# EAGLE design env (EAGLE 7.6.0)
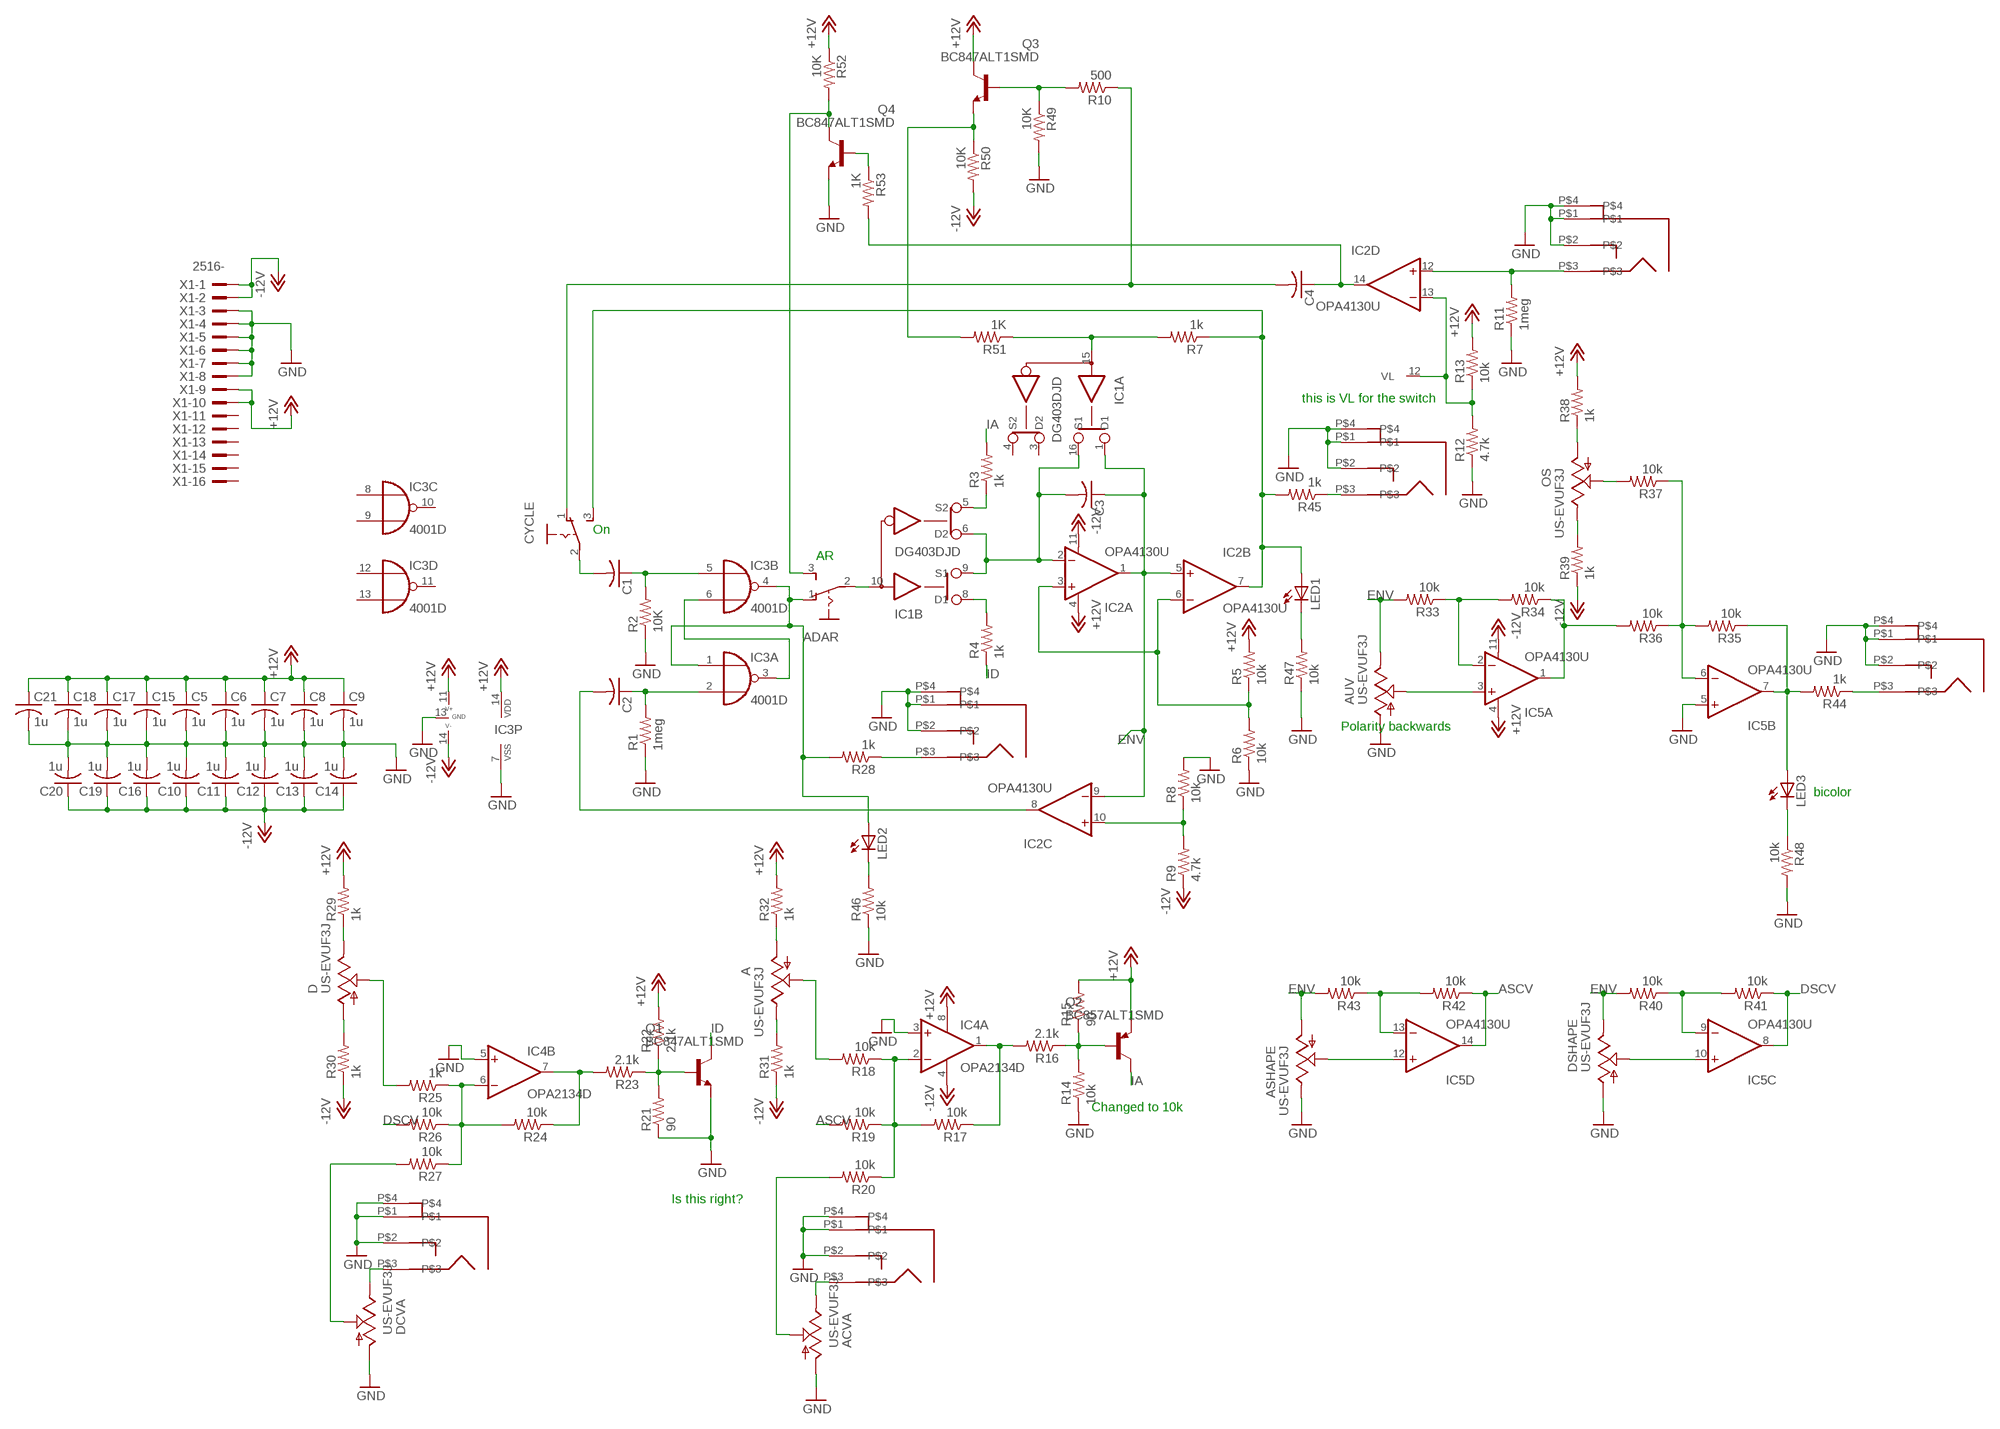
[diagram p0: schematic, sheet 1]

## Parts
A  US-EVUF3J  [EVUFXJ]
ACV  PJ301BM  [PJ301BM]
ACVA  US-EVUF3J  [EVUFXJ]
ADAR  255SB  [255SB]
ASHAPE  US-EVUF3J  [EVUFXJ]
AUV  US-EVUF3J  [EVUFXJ]
C1  C-USC0603  [C0603]
C2  C-USC0603  [C0603]
C3  C-USC0603  [C0603]
C4  C-USC0603  [C0603]
C5  1u  C-USC0603  [C0603]
C6  1u  C-USC0603  [C0603]
C7  1u  C-USC0603  [C0603]
C8  1u  C-USC0603  [C0603]
C9  1u  C-USC0603  [C0603]
C10  1u  C-USC0603  [C0603]
C11  1u  C-USC0603  [C0603]
C12  1u  C-USC0603  [C0603]
C13  1u  C-USC0603  [C0603]
C14  1u  C-USC0603  [C0603]
C15  1u  C-USC0603  [C0603]
C16  1u  C-USC0603  [C0603]
C17  1u  C-USC0603  [C0603]
C18  1u  C-USC0603  [C0603]
C19  1u  C-USC0603  [C0603]
C20  1u  C-USC0603  [C0603]
C21  1u  C-USC0603  [C0603]
CVOUT  PJ301BM  [PJ301BM]
CYCLE  255SB  [255SB]
D  US-EVUF3J  [EVUFXJ]
DCV  PJ301BM  [PJ301BM]
DCVA  US-EVUF3J  [EVUFXJ]
DSHAPE  US-EVUF3J  [EVUFXJ]
EOF  PJ301BM  [PJ301BM]
EOR  PJ301BM  [PJ301BM]
GATE  PJ301BM  [PJ301BM]
IC1  DG403DJD  [SO16]
IC2  OPA4130U  [SO14]
IC3  4001D  [SO14]
IC4  OPA2134D  [SOIC8]
IC5  OPA4130U  [SO14]
LED1  LED5MM  [LED5MM]
LED2  LED5MM  [LED5MM]
LED3  LED5MM  [LED5MM]
OS  US-EVUF3J  [EVUFXJ]
Q1  BC847ALT1SMD  [SOT23]
Q2  BC857ALT1SMD  [SOT23-BEC]
Q3  BC847ALT1SMD  [SOT23]
Q4  BC847ALT1SMD  [SOT23]
R1  1meg  R-US_R0603  [R0603]
R2  10K  R-US_R0603  [R0603]
R3  1k  R-US_R0603  [R0603]
R4  1k  R-US_R0603  [R0603]
R5  10k  R-US_R0603  [R0603]
R6  10k  R-US_R0603  [R0603]
R7  1k  R-US_R0603  [R0603]
R8  10k  R-US_R0603  [R0603]
R9  4.7k  R-US_R0603  [R0603]
R10  500  R-US_R0603  [R0603]
R11  1meg  R-US_R0603  [R0603]
R12  4.7k  R-US_R0603  [R0603]
R13  10k  R-US_R0603  [R0603]
R14  10k  R-US_R0603  [R0603]
R15  90  R-US_R0603  [R0603]
R16  2.1k  R-US_R0603  [R0603]
R17  10k  R-US_R0603  [R0603]
R18  10k  R-US_R0603  [R0603]
R19  10k  R-US_R0603  [R0603]
R20  10k  R-US_R0603  [R0603]
R21  90  R-US_R0603  [R0603]
R22  2.1k  R-US_R0603  [R0603]
R23  2.1k  R-US_R0603  [R0603]
R24  10k  R-US_R0603  [R0603]
R25  1k  R-US_R0603  [R0603]
R26  10k  R-US_R0603  [R0603]
R27  10k  R-US_R0603  [R0603]
R28  1k  R-US_R0603  [R0603]
R29  1k  R-US_R0603  [R0603]
R30  1k  R-US_R0603  [R0603]
R31  1k  R-US_R0603  [R0603]
R32  1k  R-US_R0603  [R0603]
R33  10k  R-US_R0603  [R0603]
R34  10k  R-US_R0603  [R0603]
R35  10k  R-US_R0603  [R0603]
R36  10k  R-US_R0603  [R0603]
R37  10k  R-US_R0603  [R0603]
R38  1k  R-US_R0603  [R0603]
R39  1k  R-US_R0603  [R0603]
R40  10k  R-US_R0603  [R0603]
R41  10k  R-US_R0603  [R0603]
R42  10k  R-US_R0603  [R0603]
R43  10k  R-US_R0603  [R0603]
R44  1k  R-US_R0603  [R0603]
R45  1k  R-US_R0603  [R0603]
R46  10k  R-US_R0603  [R0603]
R47  10k  R-US_R0603  [R0603]
R48  10k  R-US_R0603  [R0603]
R49  10K  R-US_R0603  [R0603]
R50  10K  R-US_R0603  [R0603]
R51  1K  R-US_R0603  [R0603]
R52  10K  R-US_R0603  [R0603]
R53  1K  R-US_R0603  [R0603]
X1  2516-  [PAK100/2500-16]

## Nets
+12V: C5.1 C6.1 C7.1 C8.1 C9.1 C15.1 C17.1 C18.1 C21.1 IC1.11(P:V+) IC2.4(A:V+) IC3.14(P:VDD) IC4.8(P:V+) IC5.4(A:V+) Q2.E Q3.3(C) R5.2 R13.2 R15.2 R22.2 R29.2 R32.2 R38.2 R52.1 X1.9 X1.10
-12V: C10.1 C11.1 C12.1 C13.1 C14.1 C16.1 C19.1 C20.1 IC1.14(P:V-) IC2.11(A:V-) IC4.4(P:V-) IC5.11(A:V-) R9.1 R30.1 R31.1 R39.1 R50.2 X1.1 X1.2
ASCV: IC5.14(D:OUT) R19.2 R42.1
DSCV: IC5.8(C:OUT) R26.2 R41.1
ENV: ASHAPE.1(A) AUV.3(E) C3.1 DSHAPE.3(E) IC1.1(A:D1) IC2.1(A:OUT) IC2.5(B:+IN) IC2.9(C:-IN) R33.2 R40.2 R43.2
GND: ACV.P$1 ACV.P$2 ACV.P$4 ACVA.1(A) ASHAPE.3(E) AUV.1(A) C5.2 C6.2 C7.2 C8.2 C9.2 C10.2 C11.2 C12.2 C13.2 C14.2 C15.2 C16.2 C17.2 C18.2 C19.2 C20.2 C21.2 CVOUT.P$1 CVOUT.P$2 CVOUT.P$4 DCV.P$1 DCV.P$2 DCV.P$4 DCVA.1(A) DSHAPE.1(A) EOF.P$1 EOF.P$2 EOF.P$4 EOR.P$1 EOR.P$2 EOR.P$4 GATE.P$1 GATE.P$2 GATE.P$4 IC1.13(P:GND) IC3.7(P:VSS) IC4.3(A:+IN) IC4.5(B:+IN) IC5.5(B:+IN) Q1.2(E) Q4.2(E) R1.1 R2.1 R6.1 R8.2 R11.1 R12.1 R14.1 R21.1 R46.1 R47.1 R48.2 R49.2 X1.3 X1.4 X1.5 X1.6 X1.7 X1.8
IA: Q2.C R3.2
ID: Q1.3(C) R4.1
N$1: IC3.3(A:O) IC3.6(B:I1)
N$2: ADAR.1(O) IC3.1(A:I0) IC3.4(B:O) LED2.A R28.2
N$3: C2.1 IC3.2(A:I1) R1.2
N$4: C1.1 IC3.5(B:I0) R2.2
N$5: C3.2 IC1.6(B:D2) IC1.9(B:S1) IC1.16(A:S1) IC2.2(A:-IN)
N$6: IC1.8(B:D1) R4.2
N$7: IC1.5(B:S2) R3.1
N$8: IC2.10(C:+IN) R8.1 R9.2
N$9: CYCLE.3(S) IC2.7(B:OUT) LED1.A R7.1 R45.2
N$10: AUV.2(S) IC5.3(A:+IN)
N$11: Q3.2(E) R50.1 R51.2
N$12: C2.2 IC2.8(C:OUT)
N$13: IC2.3(A:+IN) IC2.6(B:-IN) R5.1 R6.2
N$14: ADAR.3(S) Q4.3(C) R52.2
N$15: Q2.B R14.2 R15.1 R16.1
N$16: GATE.P$3 IC2.12(D:+IN) R11.2
N$17: IC1.12(VL:VL) IC2.13(D:-IN) R12.2 R13.1
N$18: ADAR.2(P) IC1.10(B:IN)
N$19: C1.2 CYCLE.2(P)
N$20: C4.1 IC2.14(D:OUT) R53.2
N$21: IC4.1(A:OUT) R16.2 R17.1
N$22: IC4.7(B:OUT) R23.2 R24.1
N$23: IC4.2(A:-IN) R17.2 R18.1 R19.1 R20.1
N$24: IC4.6(B:-IN) R24.2 R25.1 R26.1 R27.1
N$25: D.3(E) R29.1
N$26: Q1.1(B) R21.2 R22.1 R23.1
N$27: IC5.6(B:-IN) R35.2 R36.1 R37.1
N$28: A.1(A) R32.1
N$29: D.1(A) R30.2
N$30: A.3(E) R31.2
N$31: D.2(S) R25.2
N$32: A.2(S) R18.2
N$33: IC5.1(A:OUT) R34.1 R36.2
N$34: IC5.2(A:-IN) R33.1 R34.2
N$35: CVOUT.P$3 R44.1
N$36: IC5.7(B:OUT) LED3.A R35.1 R44.2
N$37: OS.1(A) R38.1
N$38: ACV.P$3 ACVA.3(E)
N$39: OS.3(E) R39.2
N$40: OS.2(S) R37.2
N$41: IC5.13(D:-IN) R42.2 R43.1
N$42: IC5.9(C:-IN) R40.1 R41.2
N$43: LED2.K(C) R46.2
N$44: DCV.P$3 DCVA.3(E)
N$45: ASHAPE.2(S) IC5.12(D:+IN)
N$46: DCVA.2(S) R27.2
N$47: EOR.P$3 R28.1
N$48: DSHAPE.2(S) IC5.10(C:+IN)
N$49: EOF.P$3 R45.1
N$50: ACVA.2(S) R20.2
N$51: Q3.1(B) R10.2 R49.1
N$53: LED1.K(C) R47.2
N$54: IC1.15(A:IN) R7.2 R51.1
N$55: C4.2 CYCLE.1(O) R10.1
N$56: Q4.1(B) R53.1
N$57: LED3.K(C) R48.1
Unconnected: IC1.3(A:D2) IC1.4(A:S2) IC3.8(C:I0) IC3.9(C:I1) IC3.10(C:O) IC3.11(D:O) IC3.12(D:I0) IC3.13(D:I1) X1.11 X1.12 X1.13 X1.14 X1.15 X1.16

## Notes on the sheet
- this is VL for the switch
- On
- AR
- Polarity backwards
- bicolor
- Changed to 10k
- Is this right?

## Library data of the parts
A ACVA ASHAPE AUV D DCVA DSHAPE OS = dan:US-EVU: 9 mm Square Rotary Potentiometers Source: Panasonic
ACV CVOUT DCV EOF EOR GATE = dan:PJ301BM
ADAR CYCLE = dan:255SB: SLIDING SWITCH Distributor Buerklin, 11G810
C1-C21 = dan:C-US: CAPACITOR, American symbol
IC1 = dan:DG403DJ: CMOS SWITCH
IC2 IC5 = dan:OPA4130: Low Power, Precision FET-Input Operational Amplifiers; MF: TEXAS INSTRUMENTS; MPN: OPA4130UA; OC_FARNELL: 1648707; OC_NEWARK: 80K8080
IC3 = dan:4001: Quad 2-input NOR
IC4 = dan:OPA2134: SoundPLUS (TM) High Performance AUDIO OPERATIONAL AMPLIFIERS Source: http://focus.ti.com/lit/ds/sbos058/sbos058.pdf
LED1-LED3 = dan:LED: LED OSRAM: - CHIPLED LG R971, LG N971, LY N971, LG Q971, LY Q971, LO R971, LY R971 LH N974, LH R974 LS Q976, LO Q976, LY Q976 LO Q996 - Hyper CHIPLED LW Q18S LB Q993, LB Q99A, LB R99A - SideLED LS A670, LO A670, LY A670, LG A670, LP A670 LB A673, LV A673, LT A673, LW A673 LH A674 LY A675 LS A676, LA A676, LO A676, LY A676, LW A676 LS A679, LY A679, LG A679 - Hyper Micro SIDELED® LS Y876, LA Y876, LO Y876, LY Y876 LT Y87S - SmartLED LW L88C, LW L88S LB L89C, LB L89S, LG L890 LS L89K, LO L89K, LY L89K LS L896, LA L896, LO L896, LY L896 - TOPLED LS T670, LO T670, LY T670, LG T670, LP T670 LSG T670, LSP T670, LSY T670, LOP T670, LYG T670 LG T671, LOG T671, LSG T671 LB T673, LV T673, LT T673, LW T673 LH T674 LS T676, LA T676, LO T676, LY T676, LB T676, LH T676, LSB T676, LW T676 LB T67C, LV T67C, LT T67C, LS T67K, LO T67K, LY T67K, LW E67C LS E67B, LA E67B, LO E67B, LY E67B, LB E67C, LV E67C, LT E67C LW T67C LS T679, LY T679, LG T679 LS T770, LO T770, LY T770, LG T770, LP T770 LB T773, LV T773, LT T773, LW T773 LH T774 LS E675, LA E675, LY E675, LS T675 LS T776, LA T776, LO T776, LY T776, LB T776 LHGB T686 LT T68C, LB T68C - Hyper Mini TOPLED® LB M676 - Mini TOPLED Santana® LG M470 LS M47K, LO M47K, LY M47K Source: http://www.osram.convergy.de LUXEON: - LUMILED® LXK2-PW12-R00, LXK2-PW12-S00, LXK2-PW14-U00, LXK2-PW14-V00 LXK2-PM12-R00, LXK2-PM12-S00, LXK2-PM14-U00 LXK2-PE12-Q00, LXK2-PE12-R00, LXK2-PE12-S00, LXK2-PE14-T00, LXK2-PE14-U00 LXK2-PB12-K00, LXK2-PB12-L00, LXK2-PB12-M00, LXK2-PB14-N00, LXK2-PB14-P00, LXK2-PB14-Q00 LXK2-PR12-L00, LXK2-PR12-M00, LXK2-PR14-Q00, LXK2-PR14-R00 LXK2-PD12-Q00, LXK2-PD12-R00, LXK2-PD12-S00 LXK2-PH12-R00, LXK2-PH12-S00 LXK2-PL12-P00, LXK2-PL12-Q00, LXK2-PL12-R00 Source: www.luxeon.com KINGBRIGHT: KA-3528ASYC Source: www.kingbright.com
Q1 Q3 Q4 = dan:BC847*: NPN Transistor
Q2 = dan:BC857*: PNP Transistror
R1-R53 = dan:R-US_: RESISTOR, American symbol
X1 = dan:2516-: 3M (TM) Pak 100 4-Wall Header Source: 3M; OC_FARNELL: unknown; OC_NEWARK: unknown

## Board
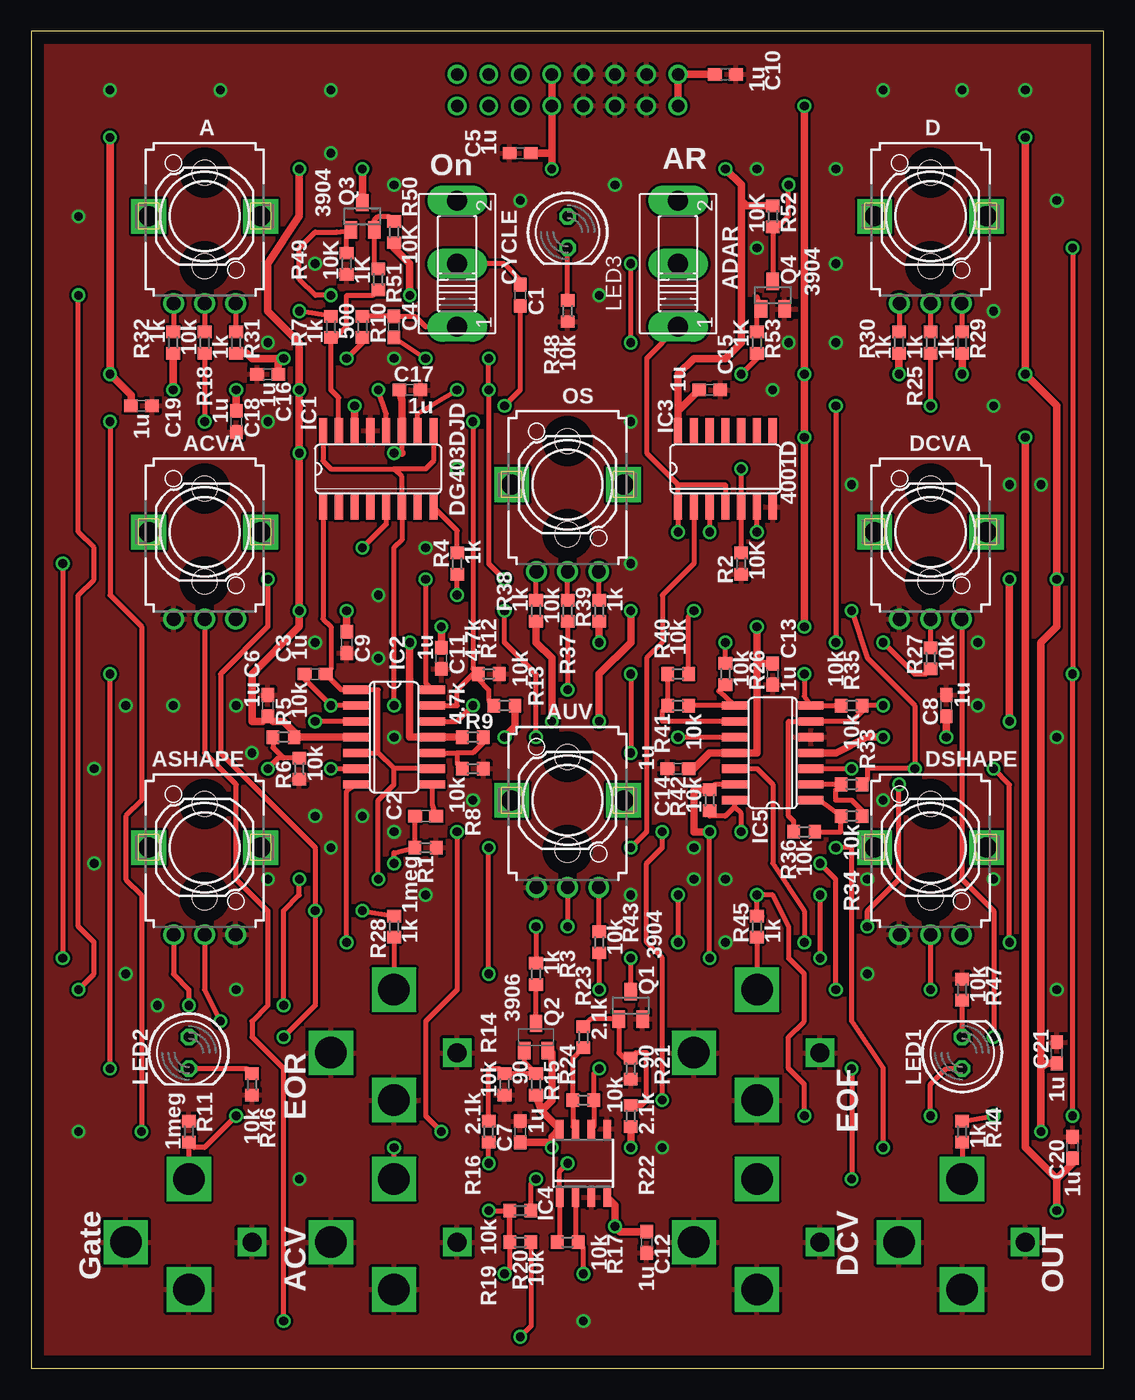
[diagram p1: board, top side]
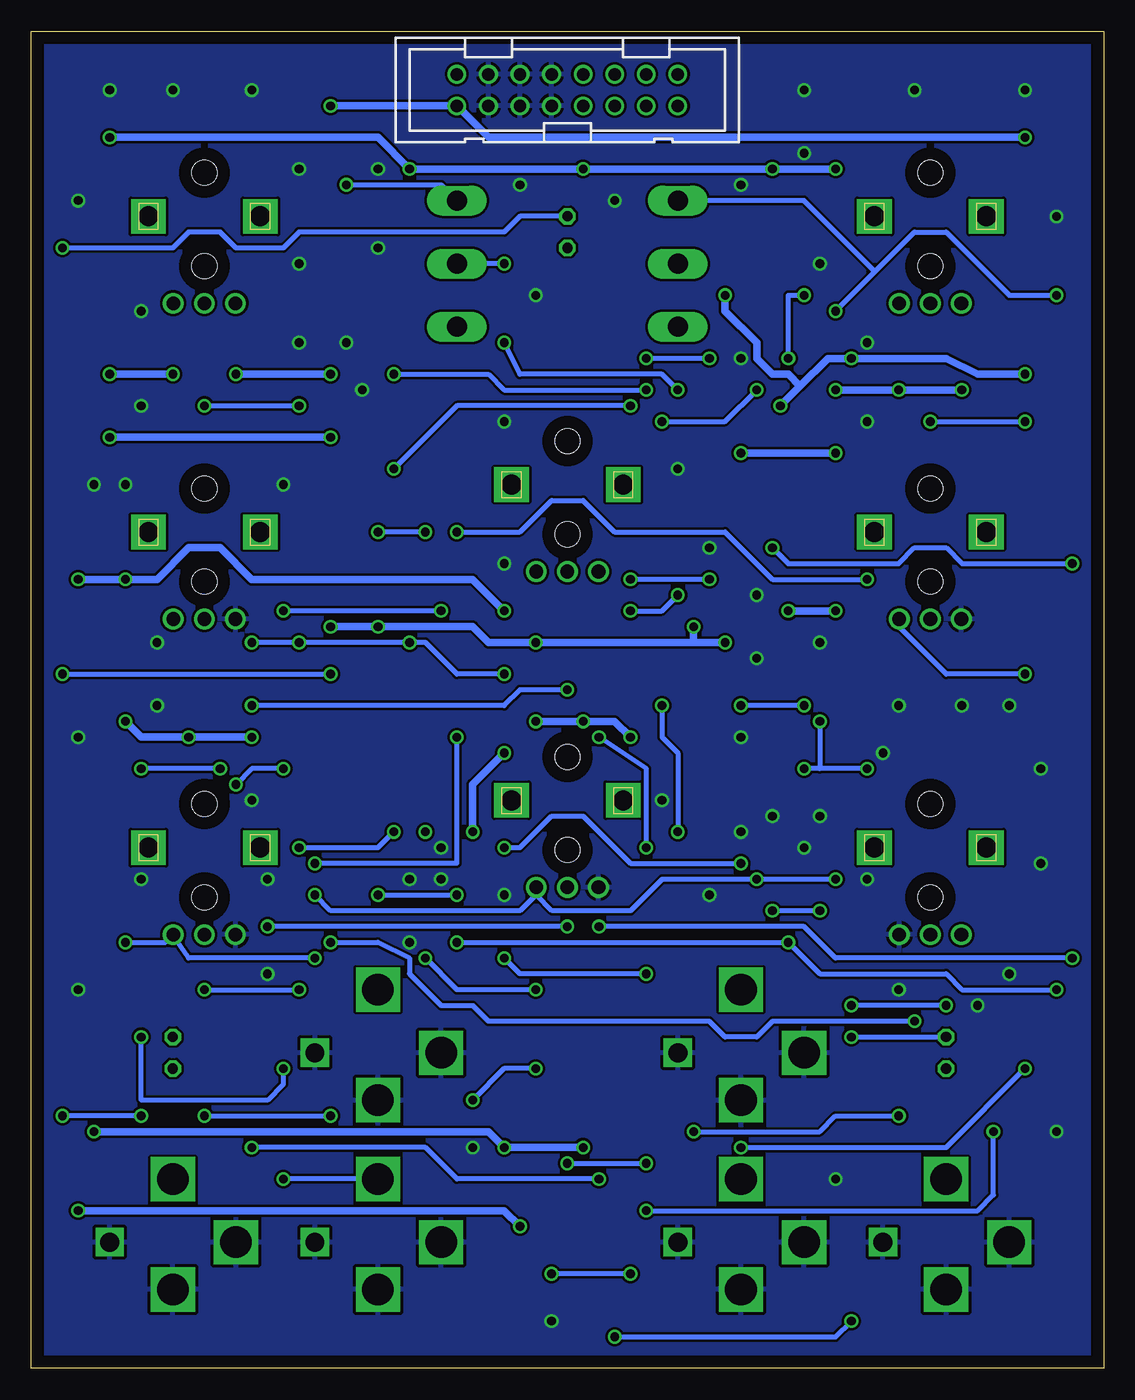
[diagram p2: board, bottom side, seen from below]

Size 86.34 x 107.62 mm. Coordinates in mm from the lower left corner, seen from the top.
Outline: 0,0 86.34,0 86.34,107.62 0,107.62 0,0
Copper layers (1*16): Top 0.035mm / dielectric 1.5mm / Bottom 0.035mm
Design rules "default": minimum track width 10mil, minimum drill 24mil, track to track 8mil, track to pad 8mil, pad to pad 8mil, via to via 8mil, smd to smd 8mil, copper to edge 40mil, drill to drill 8mil, minimum pad ring 10mil, minimum via ring 8mil, stop-mask expansion 4mil, vias tented up to drill 0mil, thermal gap 10mil

### Footprints (pad centres in the part's own frame; a part is rotated, then mirrored left to right if it is on the bottom)
EVUFXJ = drill 1.1 pad 1.676: 1 -2.5,-7; 2 0,-7; 3 2.5,-7 | drill 1.6 pad 2.8 square: M1 4.5,0; M2 -4.5,0 | hole 2: 0,3.5; 0,-4
PJ301BM = drill 1.524 square: P$1 5.08,0 | drill 2.54 square: P$2 0,-3.81; P$3 0,5.08; P$4 -5.08,0
255SB = drill 1.6 long: 1 -5.08,0; 2 0,0; 3 5.08,0
C0603 = smd 1.1 x 1: 1 -0.85,0; 2 0.85,0
SO16 = smd 0.66 x 2.032: 1 -4.445,-3.073; 2 -3.175,-3.073; 3 -1.905,-3.073; 4 -0.635,-3.073; 5 0.635,-3.073; 6 1.905,-3.073; 7 3.175,-3.073; 8 4.445,-3.073; 9 4.445,3.073; 10 3.175,3.073; 11 1.905,3.073; 12 0.635,3.073; 13 -0.635,3.073; 14 -1.905,3.073; 15 -3.175,3.073; 16 -4.445,3.073
SO14 = smd 0.66 x 2.032: 1 -3.81,-3.073; 2 -2.54,-3.073; 3 -1.27,-3.073; 4 0,-3.073; 5 1.27,-3.073; 6 2.54,-3.073; 7 3.81,-3.073; 8 3.81,3.073; 9 2.54,3.073; 10 1.27,3.073; 11 0,3.073; 12 -1.27,3.073; 13 -2.54,3.073; 14 -3.81,3.073
SOIC8 = smd 0.6 x 1.5: 1 -1.905,-2.75; 2 -0.635,-2.75; 3 0.635,-2.75; 4 1.905,-2.75; 5 1.905,2.75; 6 0.635,2.75; 7 -0.635,2.75; 8 -1.905,2.75
LED5MM = drill 0.813 octagon: A -1.27,0; K 1.27,0
SOT23 = smd 1 x 1.4: 1 -0.95,-1.1; 2 0.95,-1.1; 3 0,1.1
SOT23-BEC = smd 1 x 1.4: B -0.95,-1.1; C 0,1.1; E 0.95,-1.1
R0603 = smd 1 x 1.1: 1 -0.85,0; 2 0.85,0
PAK100/2500-16 = drill 1 pad 1.422: 1 -8.89,-1.27; 2 -8.89,1.27; 3 -6.35,-1.27; 4 -6.35,1.27; 5 -3.81,-1.27; 6 -3.81,1.27; 7 -1.27,-1.27; 8 -1.27,1.27; 9 1.27,-1.27; 10 1.27,1.27; 11 3.81,-1.27; 12 3.81,1.27; 13 6.35,-1.27; 14 6.35,1.27; 15 8.89,-1.27; 16 8.89,1.27

### Placement (x,y rotation side)
A  13.97,92.71 0 top
ACV  29.21,10.16 0 top
ACVA  13.97,67.31 0 top
ADAR  52.07,88.9 90 top
ASHAPE  13.97,41.91 0 top
AUV  43.18,45.72 0 top
C1  39.37,86.36 90 top
C2  31.75,44.45 0 top
C3  22.86,55.88 180 top
C4  29.21,83.82 90 top
C5  39.37,97.79 180 top
C6  19.05,53.34 90 top
C7  39.37,19.05 90 top
C8  73.66,53.34 90 top
C9  25.4,58.42 270 top
C10  55.88,104.14 0 top
C11  33.02,57.15 270 top
C12  49.53,10.16 270 top
C13  59.69,55.88 270 top
C14  52.07,48.26 180 top
C15  54.61,78.74 0 top
C16  19.05,80.01 180 top
C17  30.48,78.74 0 top
C18  16.51,76.2 270 top
C19  8.89,77.47 0 top
C20  83.82,17.78 90 top
C21  82.55,25.4 90 top
CVOUT  74.93,10.16 0 top
CYCLE  34.29,88.9 90 top
D  72.39,92.71 0 top
DCV  58.42,10.16 0 top
DCVA  72.39,67.31 0 top
DSHAPE  72.39,41.91 0 top
EOF  58.42,25.4 0 top
EOR  29.21,25.4 0 top
GATE  12.7,10.16 0 top
IC1  27.94,72.39 0 top
IC2  29.21,50.8 270 top
IC3  55.88,72.39 0 top
IC4  44.45,16.51 0 top
IC5  59.69,49.53 90 top
LED1  74.93,25.4 90 top
LED2  12.7,25.4 270 top
LED3  43.18,91.44 270 top
OS  43.18,71.12 0 top
Q1  48.26,29.21 0 top
Q2  40.64,26.67 0 top
Q3  26.67,92.71 0 top
Q4  59.69,86.36 0 top
R1  31.75,41.91 180 top
R2  57.15,64.77 90 top
R3  40.64,31.75 270 top
R4  34.29,64.77 90 top
R5  20.32,50.8 0 top
R6  21.59,48.26 90 top
R7  24.13,83.82 270 top
R8  35.56,48.26 0 top
R9  35.56,50.8 0 top
R10  26.67,83.82 270 top
R11  12.7,19.05 270 top
R12  36.83,55.88 180 top
R13  38.1,53.34 0 top
R14  38.1,22.86 90 top
R15  40.64,22.86 270 top
R16  36.83,19.05 270 top
R17  43.18,10.16 0 top
R18  13.97,82.55 90 top
R19  39.37,12.7 0 top
R20  39.37,10.16 0 top
R21  48.26,24.13 90 top
R22  48.26,20.32 270 top
R23  44.45,26.67 270 top
R24  44.45,21.59 0 top
R25  72.39,82.55 90 top
R26  55.88,55.88 270 top
R27  72.39,57.15 90 top
R28  29.21,35.56 90 top
R29  74.93,82.55 270 top
R30  69.85,82.55 90 top
R31  16.51,82.55 90 top
R32  11.43,82.55 270 top
R33  66.04,46.99 0 top
R34  66.04,44.45 0 top
R35  66.04,53.34 0 top
R36  62.23,43.18 0 top
R37  43.18,60.96 90 top
R38  40.64,60.96 270 top
R39  45.72,60.96 90 top
R40  52.07,55.88 0 top
R41  52.07,53.34 180 top
R42  54.61,45.72 90 top
R43  45.72,34.29 90 top
R44  74.93,19.05 90 top
R45  58.42,35.56 90 top
R46  17.78,22.86 90 top
R47  74.93,30.48 270 top
R48  43.18,85.09 270 top
R49  25.4,88.9 270 top
R50  29.21,91.44 270 top
R51  27.94,87.63 90 top
R52  59.69,92.71 270 top
R53  58.42,82.55 270 top
X1  43.18,102.87 0 bottom

### Tracks (layer width: path | path; a pad name or v marks a point on that pad's centre or on a via)
+12V  (via drill 0.7)
  Top 0.406: 41.76,25.4 Q2.E | 41.06,20.74 | 29.84,73.66 IC1.11 | R5.2 21.17,51.22
  Top 0.61: R5.2 IC2.4 | R15.2 41.06,20.74 41.91,21.59 41.91,25.4 41.76,25.4 | 41.06,20.74 IC4.8 41.91,18.62 v41.91,17.78 41.49,18.2 C7.1 | R22.2 v48.26,17.78 | X1.10 X1.9 41.91,97.79 | 41.91,97.79 v41.91,96.52 | R29.2 v74.93,80.01 | v80.01,99.06 v80.01,80.01 82.55,77.47 v82.55,63.5 82.55,59.69 81.28,58.42 81.28,24.13 | IC5.4 64.77,49.53 67.31,50.8 v68.58,50.8 | 81.28,24.13 v81.28,19.05 | v78.74,52.07 v78.74,63.5 | C5.1 41.91,97.79 | C8.1 v73.66,50.8 | C9.1 v25.4,60.96 | R13.2 38.95,51.65 v38.1,50.8 | v29.21,73.66 29.84,73.66 | C17.1 29.84,77.89 IC1.11 | C15.1 52.07,77.05 IC3.14 52.07,80.01 53.34,81.28 55.88,81.28 57.15,82.55 57.15,93.98 | 57.15,93.98 57.15,95.25 v55.88,96.52 | C18.1 v16.51,78.74 | C21.1 81.7,24.55 81.28,24.13 | Q3.3 v26.67,96.52 | R52.1 57.57,93.56 57.15,93.98 | 21.17,51.22 20.32,52.07 19.47,52.07 C6.1 18.63,52.07 17.78,52.07 17.78,55.88 21.59,59.69 v21.59,60.96 v21.59,73.66 v21.59,78.74 21.59,82.55 19.05,85.09 19.05,88.9 21.59,92.71 v21.59,96.52 | R38.2 40.64,58.42 41.91,57.15 v41.91,52.07 | v48.26,60.96 48.26,58.42 45.72,55.88 v45.72,52.07 | R32.2 v11.43,78.74
  Bottom 0.61: v41.91,17.78 v48.26,17.78 49.53,19.05 v81.28,19.05 | v21.59,96.52 v26.67,96.52 v41.91,96.52 v55.88,96.52 58.42,99.06 v80.01,99.06 | v21.59,78.74 v16.51,78.74 v11.43,78.74 | v74.93,80.01 v80.01,80.01 | v48.26,60.96 50.8,63.5 68.58,63.5 71.12,66.04 73.66,66.04 76.2,63.5 v78.74,63.5 v82.55,63.5 | v68.58,50.8 v73.66,50.8 77.47,50.8 v78.74,52.07 | v25.4,60.96 v21.59,60.96 | v38.1,50.8 39.37,52.07 v41.91,52.07 v45.72,52.07 | v29.21,73.66 v21.59,73.66
-12V  (via drill 0.7)
  Top 0.406: C14.1 53.34,48.26 | R50.2 29.21,90.17
  Top 0.61: R9.1 IC2.11 30.48,50.8 v30.48,58.42 | 58.42,57.15 58.42,49.53 IC5.11 54.61,49.53 53.34,48.26 | 58.42,57.15 v58.42,59.69 | X1.1 X1.2 C10.1 | v62.23,101.6 v62.23,80.01 v62.23,74.93 v62.23,59.69 | v69.85,80.01 R30.1 | v6.35,99.06 v6.35,80.01 8.04,78.32 C19.1 | IC4.4 46.99,13.12 v46.99,11.43 47.41,11.01 C12.1 | C11.1 v33.02,59.69 | C13.1 58.84,56.73 58.42,57.15 | v82.55,12.7 82.55,15.24 | 82.55,15.24 80.01,17.78 v80.01,74.93 | v26.04,77.47 IC1.14 | C20.1 83.82,16.51 82.55,15.24 | 29.21,90.17 30.48,88.9 v30.48,86.36 | C16.1 19.9,80.86 v20.32,81.28 17.78,81.28 17.36,81.7 R31.1 | R39.1 v45.72,58.42
  Bottom 0.61: 33.02,58.42 v45.72,58.42 49.53,58.42 50.8,59.69 v58.42,59.69 v62.23,59.69 | v62.23,101.6 X1.1 49.53,99.06 v6.35,99.06 | v62.23,80.01 v69.85,80.01 | v6.35,80.01 10.16,80.01 12.7,81.28 v20.32,81.28 22.23,81.28 24.45,79.06 | v62.23,74.93 v80.01,74.93 | v82.55,12.7 48.26,12.7 v46.99,11.43 | 33.02,58.42 v30.48,58.42 | v33.02,59.69 33.02,58.42 | 24.45,79.06 v26.04,77.47 | v30.48,86.36 30.48,85.09 27.94,82.55 27.94,81.28 26.67,80.01 25.4,80.01 24.45,79.06
ASCV  (via drill 0.7)
  Top 0.406: IC5.14 56.62,45.19 | 56.62,45.19 55.88,44.45 54.61,44.45 R42.1 | R19.2 40.22,14.82 v40.64,15.24 | v68.58,17.78 68.58,24.13 66.04,27.94 66.04,41.91 v64.77,41.91 | v57.15,43.18 57.15,44.65 56.62,45.19
  Bottom 0.406: v40.64,15.24 52.07,15.24 54.61,17.78 v68.58,17.78 | v64.77,41.91 58.42,41.91 v57.15,43.18
DSCV
  Top 0.406: R41.1 IC5.8 55.35,54.5 R26.2
ENV  (via drill 0.7)
  Top 0.406: AUV.3 45.68,35.18 R43.2 | IC2.5 27.94,49.53 | 27.94,49.53 27.94,54.61 IC2.1 24.98,54.61 C3.1 24.13,56.3 24.13,59.69 23.5,60.33 IC1.1 | 29.21,48.26 27.94,49.53 | IC2.9 29.21,48.26 | R33.2 67.31,47.41 67.31,48.26 v71.12,48.26 71.12,53.34 67.31,57.15 v66.04,60.96 | R40.2 52.92,60.54 v53.34,60.96 | v20.32,29.21 20.32,36.83 21.59,38.1 v21.59,39.37 | v27.94,39.37 27.94,45.72 29.21,46.99 29.21,48.26 | v63.5,38.1 v63.5,33.02 | 74.93,34.87 DSHAPE.3 | v78.74,34.29 78.74,46.99 v77.47,48.26 | ASHAPE.1 11.47,31.71 12.7,30.48 v12.7,29.21
  Bottom 0.406: v21.59,39.37 v27.94,39.37 35.56,39.37 38.1,36.83 44.41,36.83 45.68,38.1 AUV.3 45.68,38.14 46.99,36.83 62.23,36.83 v63.5,38.1 | v71.12,48.26 v77.47,48.26 | v78.74,34.29 75.51,34.29 74.93,34.87 | v53.34,60.96 v66.04,60.96 | v63.5,33.02 73.66,33.02 74.93,34.87 | 74.93,34.87 DSHAPE.3 | v12.7,29.21 v20.32,29.21
GND  (via drill 0.7)
  other vias: 11.43,53.34 27.94,62.23 16.51,53.34 31.75,66.04 27.94,57.15 76.2,53.34 55.88,39.37 53.34,39.37 53.34,41.91 29.21,50.8 17.78,49.53 22.86,44.45 21.59,15.24 19.05,39.37 24.13,41.91 50.8,17.78 68.58,45.72 67.31,39.37 77.47,39.37 22.86,58.42 26.67,44.45 35.56,45.72 31.75,38.1 29.21,43.18 67.31,31.75 82.55,30.48 82.55,50.8 77.47,77.47 59.69,78.74 64.77,88.9 64.77,82.55 74.93,102.87 82.55,93.98 77.47,85.09 64.77,96.52 60.96,82.55 58.42,96.52 39.37,93.98 46.99,95.25 45.72,86.36 24.13,97.79 29.21,95.25 19.05,82.55 19.05,76.2 34.29,72.39 48.26,38.1 55.88,34.29 24.13,102.87 15.24,102.87 6.35,102.87 68.58,102.87 80.01,102.87 5.08,48.26 5.08,40.64 7.62,53.34 7.62,31.75 10.16,29.21 3.81,19.05 44.45,3.81 48.26,64.77 48.26,76.2 66.04,71.12 78.74,71.12 81.28,71.12 76.2,58.42 3.81,92.71 29.21,81.28 16.51,30.48 58.42,90.17 22.86,88.9
  pour Top: -5.08,109.22 96.52,109.22 96.52,-12.7 -10.16,-10.16
  pour Bottom: -5.08,111.76 100.33,111.76 109.22,109.22 109.22,-16.51 -5.08,-17.78
IA
  Top 0.406: Q2.C R3.2
ID  (via drill 0.7)
  Top 0.406: Q1.3 v48.26,33.02 | v36.83,31.75 v36.83,41.91 | v40.64,50.8 40.64,55.88 38.1,58.42 v38.1,60.96 | v34.29,62.23 R4.1
  Bottom 0.406: v36.83,41.91 36.83,48.26 v40.64,50.8 | v36.83,31.75 46.99,31.75 v48.26,33.02 | v38.1,60.96 35.56,60.96 v34.29,62.23
N$1  (via drill 0.7)
  Top 0.406: IC3.3 v54.61,67.31 | v58.42,67.31 IC3.6
  Bottom 0.406: v54.61,67.31 v58.42,67.31
N$2  (via drill 0.7)
  Top 0.406: 52.07,71.12 IC3.1 v52.07,67.31 | 52.07,71.12 55.88,71.12 IC3.4 | ADAR.1 49.53,81.28 49.53,73.66 52.07,71.12 | v19.05,63.5 19.05,59.69 15.24,55.88 15.24,49.53 22.86,41.91 v22.86,36.83 22.86,29.21 v20.32,26.67 | v26.67,36.83 R28.2
  Bottom 0.406: v52.07,67.31 46.99,67.31 44.45,69.85 41.91,69.85 39.37,67.31 30.48,67.31 26.67,63.5 v19.05,63.5 | v22.86,36.83 v26.67,36.83 | v20.32,26.67 LED2.A
N$3  (via drill 0.7)
  Top 0.406: C2.1 R1.2 29.21,41.49 v29.21,40.64 | IC3.2 53.34,64.77 50.8,62.23 50.8,58.42 49.53,57.15 49.53,43.18 v48.26,41.91
  Bottom 0.406: v48.26,41.91 46.99,41.91 44.45,44.45 41.91,44.45 38.1,40.64 v29.21,40.64
N$4  (via drill 0.7)
  Top 0.406: R2.2 IC3.5 v57.15,72.39 | C1.1 39.37,78.74 v38.1,77.47
  Bottom 0.406: v38.1,77.47 52.07,77.47 v57.15,72.39
N$5  (via drill 0.7)
  Top 0.406: IC1.16 23.5,73.03 24.13,72.39 29.21,72.39 | 29.21,72.39 29.84,71.75 IC1.6 29.84,66.67 29.21,66.04 v29.21,53.34 | IC1.9 32.38,73.03 31.75,72.39 29.21,72.39 | IC2.2 v24.13,53.34 22.01,55.46 C3.2
  Bottom 0.406: v24.13,53.34 v29.21,53.34
N$6
  Top 0.406: R4.2 34.29,67.41 IC1.8
N$7  (via drill 0.7)
  Top 0.406: IC1.5 28.57,67.94 v26.67,66.04 | v2.54,64.77 v2.54,33.02 | v40.64,35.56 R3.1
  Bottom 0.406: v26.67,66.04 25.4,64.77 16.51,64.77 15.24,66.04 12.7,66.04 11.43,64.77 v2.54,64.77 | v2.54,33.02 21.59,33.02 24.13,35.56 v40.64,35.56
N$8
  Top 0.406: R9.2 36.41,50.38 35.56,49.53 34.29,49.53 | 34.29,49.53 34.29,48.68 R8.1 | IC2.10 34.29,49.53
N$9  (via drill 0.7)
  Top 0.406: v25.4,34.29 25.4,46.46 IC2.7 | v52.07,38.1 v52.07,34.29 | R7.1 v21.59,85.09 | v3.81,30.48 5.08,31.75 5.08,34.29 3.81,35.56 3.81,62.23 5.08,63.5 5.08,66.04 3.81,67.31 v3.81,86.36 | 58.84,36.41 R45.2 v58.42,38.1 59.69,38.1 60.96,35.56 60.96,33.02 62.23,31.75 62.23,27.94 60.96,26.67 60.96,24.13 62.23,22.86 v62.23,20.32 | v72.39,20.32 72.39,22.86 73.66,24.13 LED1.A
  Bottom 0.406: CYCLE.3 24.13,93.98 18.41,88.27 | v58.42,38.1 v52.07,38.1 | v52.07,34.29 v25.4,34.29 22.86,31.75 12.7,31.75 11.43,30.48 v3.81,30.48 | v21.59,85.09 18.41,88.27 | 18.41,88.27 15.24,91.44 12.7,91.44 7.62,86.36 v3.81,86.36 | v72.39,20.32 v62.23,20.32
N$10  (via drill 0.7)
  Top 0.406: AUV.2 v43.18,35.56 | v67.31,35.56 67.31,36.83 69.85,39.37 v69.85,46.99 | IC5.3 v66.04,48.26
  Bottom 0.406: v43.18,35.56 v67.31,35.56 | v66.04,48.26 68.58,48.26 v69.85,46.99
N$11
  Top 0.406: R50.1 28.79,92.71 27.94,92.71 27.62,92.39 Q3.2 27.62,88.8 R51.2
N$12
  Top 0.406: IC2.8 32.28,45.4 C2.2
N$13  (via drill 0.7)
  Top 0.406: v24.13,48.26 IC2.6 | R6.2 20.32,49.11 | 20.32,49.11 19.9,49.11 v19.05,48.26 | R5.1 19.47,49.96 20.32,49.11 | IC2.3 v22.86,52.07
  Bottom 0.406: v19.05,48.26 22.86,48.26 | 22.86,48.26 v24.13,48.26 | v22.86,52.07 22.86,48.26
N$14  (via drill 0.7)
  Top 0.406: Q4.3 R52.2 60.11,91.86 60.96,92.71 v60.96,95.25
  Bottom 0.406: v60.96,95.25 53.34,95.25 ADAR.3
N$15
  Top 0.406: Q2.B 39.69,24.66 R15.1 R14.2 37.68,24.13 36.83,24.13 R16.1
N$16  (via drill 0.7)
  Top 0.406: GATE.P$3 R11.2 13.12,17.78 13.97,17.78 v16.51,20.32 | v34.29,43.18 34.29,30.48 31.75,27.94 31.75,20.32 v33.02,19.05 | IC2.12 34.29,52.07 v35.56,53.34
  Bottom 0.406: v35.56,53.34 35.56,50.8 34.29,49.53 v34.29,43.18 | v33.02,19.05 22.86,19.05 21.59,20.32 v16.51,20.32
N$17  (via drill 0.7)
  Top 0.406: R12.2 35.98,55.46 36.83,54.61 36.83,53.76 R13.1 | IC2.13 34.29,53.34 34.29,54.61 35.56,55.88 R12.2 | IC1.12 28.57,76.83 v27.94,78.74 | v35.56,76.2 35.56,56.3 R12.2
  Bottom 0.406: v35.56,76.2 30.48,76.2 v27.94,78.74
N$18  (via drill 0.7)
  Top 0.406: IC1.10 31.11,76.83 v34.29,78.74 | v48.26,82.55 v48.26,88.9
  Bottom 0.406: v48.26,88.9 ADAR.2 | v34.29,78.74 35.56,80.01 46.99,80.01 v48.26,82.55
N$19
  Top 0.406: C1.2 39.37,87.63 38.1,88.9 CYCLE.2
N$20  (via drill 0.7)
  Top 0.406: C4.1 v31.75,81.28 | v31.75,63.5 31.75,55.14 IC2.14 | R53.2 58.42,81.28 v57.15,80.01 | v36.83,81.28 v36.83,78.74 36.83,64.77 v38.1,63.5
  Bottom 0.406: v31.75,81.28 v36.83,81.28 | v31.75,63.5 v38.1,63.5 | v57.15,80.01 49.53,80.01 48.26,78.74 v36.83,78.74
N$21  (via drill 0.7)
  Top 0.406: R17.1 42.55,10.38 IC4.1 42.55,15.88 v43.18,16.51 | v36.83,16.51 R16.2
  Bottom 0.406: v43.18,16.51 v36.83,16.51
N$22
  Top 0.406: R23.2 43.6,24.97 R24.1 43.6,19.48 IC4.7
N$23  (via drill 0.7)
  Top 0.406: IC4.2 43.81,10.38 R17.2 44.45,9.74 v44.45,7.62 | R20.1 R19.1 | R19.1 38.52,8.04 v38.1,7.62 | R18.1 v13.97,76.2 | v6.35,76.2 6.35,62.23 8.89,59.69 8.89,45.72 7.62,44.45 7.62,39.37 8.89,38.1 v8.89,19.05 | v36.83,12.7 R19.1
  Bottom 0.406: v38.1,7.62 v44.45,7.62 | v13.97,76.2 v6.35,76.2 | v36.83,12.7 10.16,12.7 8.89,13.97 v8.89,19.05
N$24  (via drill 0.7)
  Top 0.406: IC4.6 45.3,19.48 R24.2 45.3,23.71 v45.72,24.13 | R26.1 v55.88,58.42 | v68.58,58.42 71.12,55.88 71.97,55.88 R27.1 | v48.26,55.88 v48.26,49.53 | v50.8,21.59 50.8,33.02 49.53,34.29 49.53,40.64 50.8,41.91 v50.8,43.18 | R25.1 v72.39,77.47 | v64.77,77.47 v64.77,58.42
  Bottom 0.406: v48.26,55.88 52.07,55.88 54.61,58.42 v55.88,58.42 v64.77,58.42 v68.58,58.42 | v72.39,77.47 v64.77,77.47 | v45.72,24.13 48.26,24.13 v50.8,21.59
  Bottom 0.61: v48.26,49.53 50.8,46.99 v50.8,43.18
N$25
  Top 0.406: D.3 74.89,83.44 R29.1
N$26
  Top 0.406: R23.1 45.04,28.11 Q1.1 47.31,25.4 47.73,24.98 R21.2 48.68,25.4 49.53,25.4 49.53,21.59 49.11,21.17 R22.1
N$27  (via drill 0.7)
  Top 0.406: R36.1 61.38,44.03 60.96,44.45 60.96,52.07 IC5.6 66.04,52.07 66.89,52.92 R35.2 v68.58,53.34 | R37.1 v43.18,54.61
  Bottom 0.406: v43.18,54.61 46.99,54.61 48.26,53.34 v68.58,53.34
N$28
  Top 0.406: A.1 11.47,83.44 R32.1
N$29
  Top 0.406: D.1 69.89,83.44 R30.2
N$30
  Top 0.406: A.3 16.47,83.44 R31.2
N$31
  Top 0.406: D.2 R25.2
N$32
  Top 0.406: A.2 R18.2
N$33
  Top 0.406: 62.23,45.72 IC5.1 63.5,45.72 R34.1 65.19,43.18 R36.2
N$34
  Top 0.406: IC5.2 R33.1 64.77,46.57 64.77,45.72 66.04,45.72 66.89,44.87 R34.2
N$35
  Top 0.406: R44.1 CVOUT.P$3
N$36  (via drill 0.7)
  Top 0.406: R35.1 IC5.7 62.23,54.08 v62.23,55.88 | R44.2 v77.47,20.32 | v83.82,20.32 v83.82,55.88 v83.82,90.17
  Bottom 0.406: v77.47,20.32 v83.82,20.32 | v83.82,55.88 v62.23,55.88 | v83.82,90.17 74.93,90.17 73.66,91.44 71.12,91.44 69.85,90.17 66.04,90.17 64.77,91.44 48.26,91.44 46.99,92.71 LED3.A
N$37
  Top 0.406: R38.1 40.64,64.08 OS.1
N$38  (via drill 0.7)
  Top 0.406: ACV.P$3 v29.21,17.78 | v6.35,24.13 v6.35,55.88
  Bottom 0.406: v29.21,17.78 12.7,17.78 v6.35,24.13 | v6.35,55.88 12.7,55.88 16.51,59.69 16.51,60.27 ACVA.3
N$39
  Top 0.406: R39.2 45.72,64.08 OS.3
N$40
  Top 0.406: R37.2 OS.2
N$41  (via drill 0.7)
  Top 0.406: IC5.13 55.03,46.99 R42.2 | R43.1 v45.72,30.48 | v54.61,33.02 v54.61,43.18
  Top 0.61: R42.2 53.34,46.57 53.34,43.18 v54.61,43.18
  Bottom 0.406: v45.72,30.48 52.07,30.48 v54.61,33.02
N$42
  Top 0.406: IC5.9 50.8,52.07 50.8,52.92 R41.2 R40.1
N$43
  Top 0.406: LED2.K 17.36,24.13 R46.2
N$44  (via drill 0.7)
  Top 0.406: DCVA.3 74.89,39.41 77.47,36.83 v77.47,26.67 | v66.04,24.13 v66.04,15.24
  Bottom 0.406: DCV.P$3 v66.04,15.24 | v66.04,24.13 66.04,22.86 67.31,21.59 77.47,21.59 v77.47,26.67
N$45  (via drill 0.7)
  Top 0.406: ASHAPE.2 13.97,30.48 v15.24,27.94 | IC5.12 58.42,48.26 59.69,46.99 59.69,40.64 62.23,36.83 v62.23,34.29
  Bottom 0.406: v15.24,27.94 26.67,27.94 27.94,26.67 30.48,26.67 31.75,27.94 49.53,27.94 50.8,29.21 53.34,29.21 55.88,31.75 55.88,33.02 58.42,34.29 v62.23,34.29
N$46
  Top 0.406: DCVA.2 R27.2
N$47
  Top 0.406: R28.1 EOR.P$3
N$48  (via drill 0.7)
  Top 0.406: v52.07,50.8 IC5.10 | v63.5,40.64 64.77,39.37 v64.77,30.48 | DSHAPE.2 v72.39,30.48
  Bottom 0.406: v63.5,40.64 52.07,40.64 v52.07,50.8 | v72.39,30.48 v64.77,30.48
N$49
  Top 0.406: R45.1 EOF.P$3
N$50  (via drill 0.7)
  Top 0.406: R20.2 40.22,3.39 v39.37,2.54 | v20.32,3.81 20.32,24.13 17.78,26.67 17.78,27.94 19.05,29.21 19.05,36.83 16.51,39.37 16.51,46.99 13.97,49.53 ACVA.2
  Bottom 0.406: v39.37,2.54 21.59,2.54 v20.32,3.81
N$51  (via drill 0.7)
  Top 0.406: 25.4,90.17 R49.1 25.4,91.29 Q3.1 24.62,91.44 22.86,91.44 21.59,90.17 21.59,87.63 22.86,86.36 v24.13,86.36 | R10.2 26.67,82.55 v25.4,81.28
  Bottom 0.406: v25.4,81.28 25.4,86.36 v24.13,86.36
N$53
  Top 0.406: LED1.K R47.2
N$54
  Top 0.406: IC1.15 24.77,78.11 24.13,78.74 R7.2 24.55,82.97 25.4,83.82 25.4,86.36 27.52,86.36 R51.1
N$55
  Top 0.406: CYCLE.1 31.75,83.82 30.9,84.67 C4.2 R10.1
N$56
  Top 0.406: R53.1 58.42,86.21 Q4.1
N$57
  Top 0.406: R48.1 LED3.K

### Text on the board
tPlace: On | 3904 | AR | 3904 | 3904 | 3906 | EOR | EOF | Gate | DCV | ACV | OUT